# Altium project Project_Template.PrjPcb
MainProjectName: The ROS Robot Project
1 sheet, 1 parts. Net scope: global (net labels, ports and power ports of the same name join across sheets).
Board file: Project_Template.PcbDoc

## Sheet Project_Template.SchDoc
size A4; DrawnBy: Samyar Sadat Akhavi; Revision: 1.0; SheetNumber: 1; SheetTotal: 1

### Parts
?  (no value)  (graphical)

### Notes on the sheet
- Sub-Project:
- Size:
- Drawn By:
- Revision:
- Date:
- File:
- Sheet:
- of

### Library data of the parts
? = Standard Title Block